# EAGLE schematic analog_heteroThermistor_1xChannel_R3 (EAGLE 7.6.0)
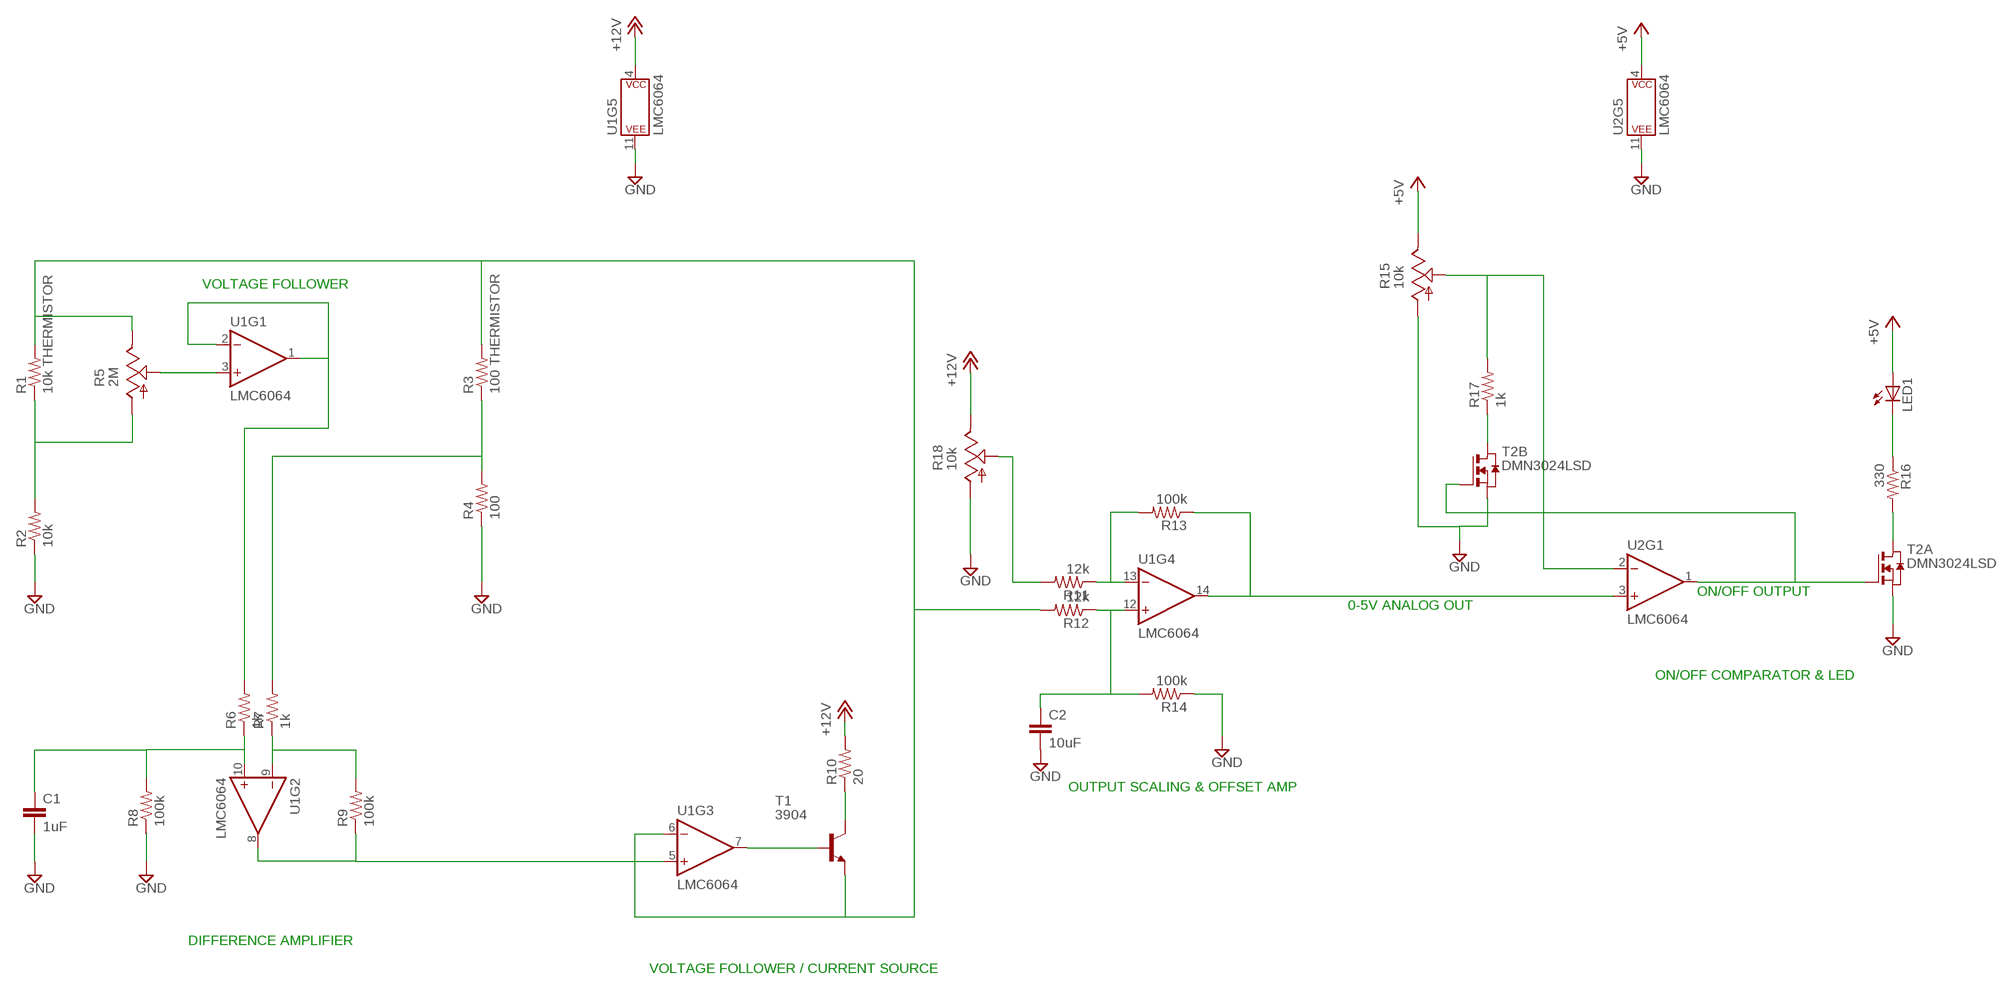
[diagram p0: schematic, sheet 1]

## Parts
C1  1uF  C-EUC0603  [C0603]
C2  10uF  C-EUC0603  [C0603]
LED1  LEDCHIPLED_1206  [CHIPLED_1206]
R1  10k THERMISTOR  R-US_R0603  [R0603]
R2  10k  R-US_R0603  [R0603]
R3  100 THERMISTOR  R-US_R0603  [R0603]
R4  100  R-US_R0603  [R0603]
R5  2M  TRIM_US-SM-42/43W  [SM-42/43W]
R6  1k  R-US_R0603  [R0603]
R7  1k  R-US_R0603  [R0603]
R8  100k  R-US_R0603  [R0603]
R9  100k  R-US_R0603  [R0603]
R10  20  R-US_R0603  [R0603]
R11  12k  R-US_R0603  [R0603]
R12  12k  R-US_R0603  [R0603]
R13  100k  R-US_R0603  [R0603]
R14  100k  R-US_R0603  [R0603]
R15  10k  TRIM_US-SM-42/43W  [SM-42/43W]
R16  330  R-US_R0603  [R0603]
R17  1k  R-US_R0603  [R0603]
R18  10k  TRIM_US-SM-42/43W  [SM-42/43W]
T1  3904  MMBT3904LT1-NPN-SOT23-BEC  [SOT23-BEC]
T2  DMN3024LSD  [SO8]
U1  LMC6064  [SO14]
U2  LMC6064  [SO14]

## Nets
+5V: LED1.A R15.3(E) U2.4(P$V+)
+12V: R10.2 R18.3(E) U1.4(P$V+)
GND: C1.2 C2.2 R2.1 R4.1 R8.1 R14.1 R15.1(A) R18.1(A) T2.1(A:S) T2.3(B:S) U1.11(P$V-) U2.11(P$V-)
N$1: R5.2(S) U1.3(+IN)
N$2: T2.2(A:G) T2.4(B:G) U2.1(OUT)
N$3: R1.1 R2.2 R5.1(A)
N$4: T1.B U1.7(OUT)
N$5: R6.2 U1.1(OUT) U1.2(-IN)
N$6: C1.1 R6.1 R8.2 U1.10(+IN)
N$7: R7.1 R9.2 U1.9(-IN)
N$8: R9.1 U1.5(+IN) U1.8(OUT)
N$9: R3.1 R4.2 R7.2
N$10: R1.2 R3.2 R5.3(E) R12.2 T1.E U1.6(-IN)
N$11: R10.1 T1.C
N$12: C2.1 R12.1 R14.2 U1.12(+IN)
N$13: R11.1 R13.2 U1.13(-IN)
N$14: R15.2(S) R17.2 U2.2(-IN)
N$15: R13.1 U1.14(OUT) U2.3(+IN)
N$16: R16.2 T2.7(A:D) T2.8(A:D)
N$17: LED1.C R16.1
N$20: R17.1 T2.5(B:D) T2.6(B:D)
N$22: R11.2 R18.2(S)
Unconnected: U2.5(+IN) U2.6(-IN) U2.7(OUT) U2.8(OUT) U2.9(-IN) U2.10(+IN) U2.12(+IN) U2.13(-IN) U2.14(OUT)

## Notes on the sheet
- VOLTAGE FOLLOWER
- ON/OFF OUTPUT
- 0-5V ANALOG OUT
- ON/OFF COMPARATOR & LED
- OUTPUT SCALING & OFFSET AMP
- DIFFERENCE AMPLIFIER
- VOLTAGE FOLLOWER / CURRENT SOURCE

## Library data of the parts
C1 = resistor:C-EU: CAPACITOR, European symbol; DISTR: Digikey; DISTRPN: 490-1536-1-ND; MF: Murata Electronics North America; MPN: GRM188R61C105KA93D
C2 = resistor:C-EU: CAPACITOR, European symbol; DISTR: Digikey; DISTRPN: 490-7198-1-ND; MF: Murata Electronics North America; MPN: GRM188C81C106MA73D
LED1 = led:LED: LED OSRAM: - CHIPLED LG R971, LG N971, LY N971, LG Q971, LY Q971, LO R971, LY R971 LH N974, LH R974 LS Q976, LO Q976, LY Q976 LO Q996 - Hyper CHIPLED LW Q18S LB Q993, LB Q99A, LB R99A - SideLED LS A670, LO A670, LY A670, LG A670, LP A670 LB A673, LV A673, LT A673, LW A673 LH A674 LY A675 LS A676, LA A676, LO A676, LY A676, LW A676 LS A679, LY A679, LG A679 - Hyper Micro SIDELED® LS Y876, LA Y876, LO Y876, LY Y876 LT Y87S - SmartLED LW L88C, LW L88S LB L89C, LB L89S, LG L890 LS L89K, LO L89K, LY L89K LS L896, LA L896, LO L896, LY L896 - TOPLED LS T670, LO T670, LY T670, LG T670, LP T670 LSG T670, LSP T670, LSY T670, LOP T670, LYG T670 LG T671, LOG T671, LSG T671 LB T673, LV T673, LT T673, LW T673 LH T674 LS T676, LA T676, LO T676, LY T676, LB T676, LH T676, LSB T676, LW T676 LB T67C, LV T67C, LT T67C, LS T67K, LO T67K, LY T67K, LW E67C LS E67B, LA E67B, LO E67B, LY E67B, LB E67C, LV E67C, LT E67C LW T67C LS T679, LY T679, LG T679 LS T770, LO T770, LY T770, LG T770, LP T770 LB T773, LV T773, LT T773, LW T773 LH T774 LS E675, LA E675, LY E675, LS T675 LS T776, LA T776, LO T776, LY T776, LB T776 LHGB T686 LT T68C, LB T68C - Hyper Mini TOPLED® LB M676 - Mini TOPLED Santana® LG M470 LS M47K, LO M47K, LY M47K Source: http://www.osram.convergy.de LUXEON: - LUMILED® LXK2-PW12-R00, LXK2-PW12-S00, LXK2-PW14-U00, LXK2-PW14-V00 LXK2-PM12-R00, LXK2-PM12-S00, LXK2-PM14-U00 LXK2-PE12-Q00, LXK2-PE12-R00, LXK2-PE12-S00, LXK2-PE14-T00, LXK2-PE14-U00 LXK2-PB12-K00, LXK2-PB12-L00, LXK2-PB12-M00, LXK2-PB14-N00, LXK2-PB14-P00, LXK2-PB14-Q00 LXK2-PR12-L00, LXK2-PR12-M00, LXK2-PR14-Q00, LXK2-PR14-R00 LXK2-PD12-Q00, LXK2-PD12-R00, LXK2-PD12-S00 LXK2-PH12-R00, LXK2-PH12-S00 LXK2-PL12-P00, LXK2-PL12-Q00, LXK2-PL12-R00 Source: www.luxeon.com KINGBRIGHT: KA-3528ASYC Source: www.kingbright.com; DISTR: Digikey; DISTRPN: 160-1169-1-ND; MF: Lite-On Inc.; MPN: LTST-C150GKT
R1 = resistor:R-US_: RESISTOR, American symbol; DISTR: Digikey; DISTRPN: 490-2436-1-ND; MF: Murata Electronics North America; MPN: NCP18XH103J03RB
R2 = resistor:R-US_: RESISTOR, American symbol; DISTR: Digikey; DISTRPN: P10KBYCT-ND; MF: Panasonic Electronic Components; MPN: ERJ-PA3F1002V
R3 = resistor:R-US_: RESISTOR, American symbol; DISTR: Digikey; DISTRPN: 490-2434-1-ND; MF: Murata Electronics North America; MPN: NCP18XF101J03RB
R4 = resistor:R-US_: RESISTOR, American symbol; DISTR: Digikey; DISTRPN: P100BYCT-ND; MF: Panasonic Electronic Components; MPN: ERJ-PA3F1000V
R5 = pot:TRIM_US-: POTENTIOMETER; DISTR: Digikey; DISTRPN: SM-42TW205CT-ND; MF: Copal Electronics Inc.; MPN: SM-42TW205
R6 R7 R17 = resistor:R-US_: RESISTOR, American symbol; DISTR: Digikey; DISTRPN: P1.0KBYCT-ND; MF: Panasonic Electronic Components; MPN: ERJ-PA3F1001V
R8 R9 R13 R14 = resistor:R-US_: RESISTOR, American symbol; DISTR: Digikey; DISTRPN: P100KBYCT-ND; MF: Panasonic Electronic Components; MPN: ERJ-PA3F1003V
R10 = resistor:R-US_: RESISTOR, American symbol; DISTR: Digikey; DISTRPN: P20.00BYCT-ND; MF: Panasonic Electronic Components; MPN: ERJ-PA3F20R0V
R11 R12 = resistor:R-US_: RESISTOR, American symbol; DISTR: Digikey; DISTRPN: P12KBYCT-ND; MF: Panasonic Electronic Components; MPN: ERJ-PA3F1202V
R15 R18 = pot:TRIM_US-: POTENTIOMETER; DISTR: Digikey; DISTRPN: SM-42TW103CT-ND; MF: Copal Electronics Inc.; MPN: SM-42TW103
R16 = resistor:R-US_: RESISTOR, American symbol; DISTR: Digikey; DISTRPN: P330BYCT-ND; MF: Panasonic Electronic Components; MPN: ERJ-PA3F3300V
T1 = transistor-neu-to92:*-NPN-: NPN Transistror; DISTR: Digikey; DISTRPN: MMBT3904FSCT-ND; MF: Fairchild/ON Semiconductor; MPN: MMBT3904
T2 = zetex:DMN3024LSD: 30V DUAL N-CHANNEL ENHANCEMENT MODE MOSFET Source: Data sheet <http://www.diodes.com/datasheets/DMN3024LSD.pdf>; DISTR: Digikey; DISTRPN: DMN3024LSD-13DICT-ND; MF: Diodes Incorporated; MPN: DMN3024LSD-13; OC_FARNELL: unknown; OC_NEWARK: unknown
U1 U2 = SparkFun-IC-Amplifiers:LMC6064: IC LMV324 Quad Op Amp Jellybean quad op-amp Datasheet <http://cdn.sparkfun.com/datasheets/Sensors/Sound/LMV324.pdf> SparkFun Products SparkFun Sensor Kit <https://www.sparkfun.com/products/13754> (DEV-13754) SparkFun Inventor's Kit for Arduino 101 <https://www.sparkfun.com/products/13844> (KIT-13844) SparkFun Sound Detector <https://www.sparkfun.com/products/12642> (SEN-12642); DISTR: Digikey; DISTRPN: 296-35438-1-ND; MF: Texas Instruments; MPN: LMC6064AIMX/NOPB; PROD_ID: LMC6064